# EAGLE design DS18B20Modular1B (EAGLE 7.3.0)
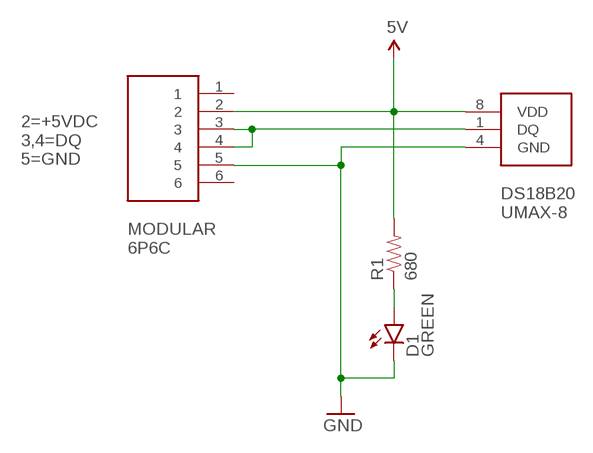
[diagram p0: schematic, sheet 1]

## Parts
D1  GREEN  LED-GREEN0603  [LED-0603]
J1  MODULAR-JACK-6P6C-1  [MODULAR-JACK-6P6C-1]
R1  680  RES-680-0805  [0805]
U$1  DS18B20UMAX-8  [UMAX-8-MAXIM]

## Nets
5V: J1.2 R1.2 U$1.8(VDD)
GND: D1.C J1.5 U$1.4(GND)
N$1: D1.A R1.1
N$2: J1.3 J1.4 U$1.1(DQ)
Unconnected: J1.1 J1.6

## Notes on the sheet
- 2=+5VDC
  3,4=DQ
  5=GND
- DS18B20
  UMAX-8
- MODULAR
  6P6C

## Library data of the parts
D1 = rickk2:LED-GREEN: Lite-On LTST-C193KGKT-5A Green 572nm LED Indication - Discrete 2V 5 mA 0603 https://www.digikey.com/product-detail/en/lite-on-inc/LTST-C193KGKT-5A/160-1828-1-ND/2356247 Res = 270 ohm @ 3.3V, Res = 680 ohm 1/8W @ 5V
J1 = rickk2:MODULAR-JACK-6P6C-1: CONN MOD JACK 6P6C R/A UNSHLD $0.77 Stewart Connector SS-7066-NF Jack Modular Connector 6p6c (RJ11, RJ12, RJ14, RJ25) 90° Angle (Right) Unshielded Cat5 https://www.digikey.com/product-detail/en/stewart-connector/SS-7066-NF/380-1043-ND/388305
R1 = rickk2:RES-680-0805: RES SMD 680 OHM 5% 1/8W 0805 $0.10 Panasonic ERJ-6GEYJ681V ±5% 0.125W, 1/8W Chip Resistor 0805 (2012 Metric) Automotive AEC-Q200 Thick Film https://www.digikey.com/product-detail/en/panasonic-electronic-components/ERJ-6GEYJ681V/P680ACT-ND/90033
U$1 = rickk2:DS18B20

## Board
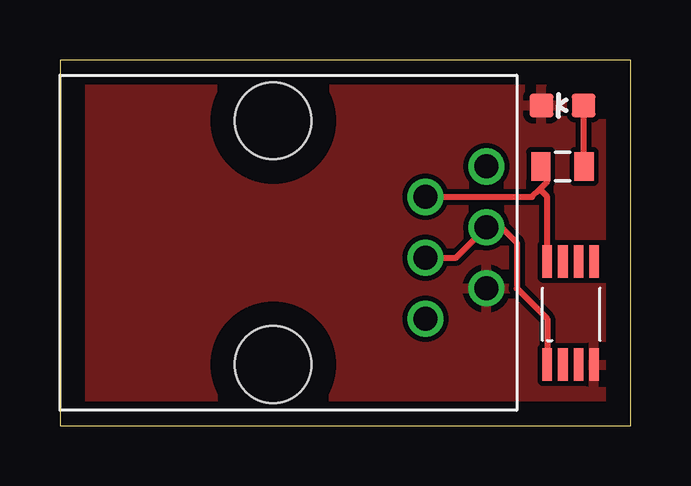
[diagram p1: board, top side]
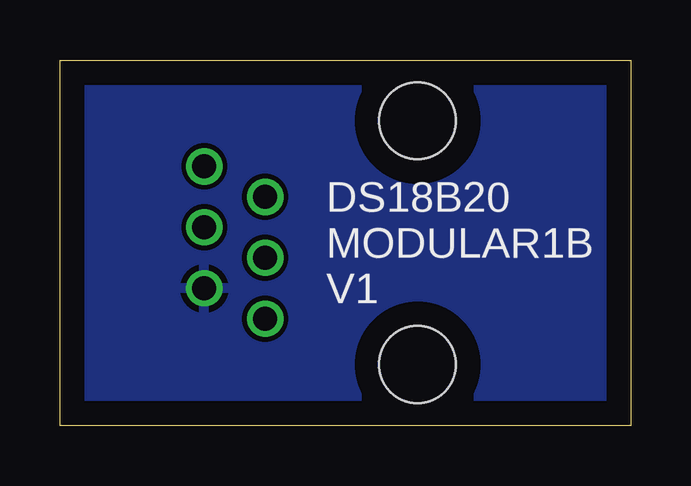
[diagram p2: board, bottom side, seen from below]

Size 23.8 x 15.23 mm. Coordinates in mm from the lower left corner, seen from the top.
Outline: 0,0 23.8,0 23.8,15.23 0,15.23 0,0
Copper layers (1*16): Top 0.035mm / dielectric 1.5mm / Bottom 0.035mm
Design rules "default": minimum track width 10mil, minimum drill 24mil, track to track 8mil, track to pad 8mil, pad to pad 8mil, via to via 8mil, smd to smd 8mil, copper to edge 40mil, drill to drill 8mil, minimum pad ring 10mil, minimum via ring 8mil, stop-mask expansion 4mil, vias tented up to drill 0mil, thermal gap 10mil

### Footprints (pad centres in the part's own frame; a part is rotated, then mirrored left to right if it is on the bottom)
LED-0603 = smd 1 x 1: A 0,-0.877; C 0,0.877
MODULAR-JACK-6P6C-1 = drill 1: 1 1.905,8.89; 2 3.175,6.35; 3 4.445,8.89; 4 5.715,6.35; 5 6.985,8.89; 6 8.255,6.35 | hole 3.2: 0,0; 10.16,0
0805 = smd 0.8 x 1.2: 1 -0.9,0; 2 0.9,0
UMAX-8-MAXIM = smd 0.4 x 1.35: 1 0,0; 2 0.65,0; 3 1.3,0; 4 1.95,0; 5 1.95,4.3; 6 1.3,4.3; 7 0.65,4.3; 8 0,4.3

### Placement (x,y rotation side)
D1  20.95,13.34 90 top
J1  8.89,12.7 270 top
R1  20.95,10.79 180 top
U$1  20.32,2.54 0 top

### Tracks (layer width: path | path; a pad name or v marks a point on that pad's centre or on a via)
5V
  Top 0.254: J1.2 19.68,9.53 20,9.84 | 20,9.84 20.32,10.16 20.32,10.53 R1.2 | U$1.8 20.32,9.53 20,9.84
GND
  pour Bottom: 0,0 0,15.24 24.13,15.24 24.13,0
  pour Top: 0,0 0,15.24 24.13,15.24 24.13,0
N$1
  Top 0.254: D1.A 21.83,10.82 R1.1
N$2
  Top 0.254: J1.4 16.51,6.99 J1.3 18.41,8.26 19.05,7.62 19.05,5.71 20.32,4.45 U$1.1

### Text on the board
bPlace: DS18B20 / MODULAR1B / V1